# EAGLE design glcd_240x128 (EAGLE 5.06)
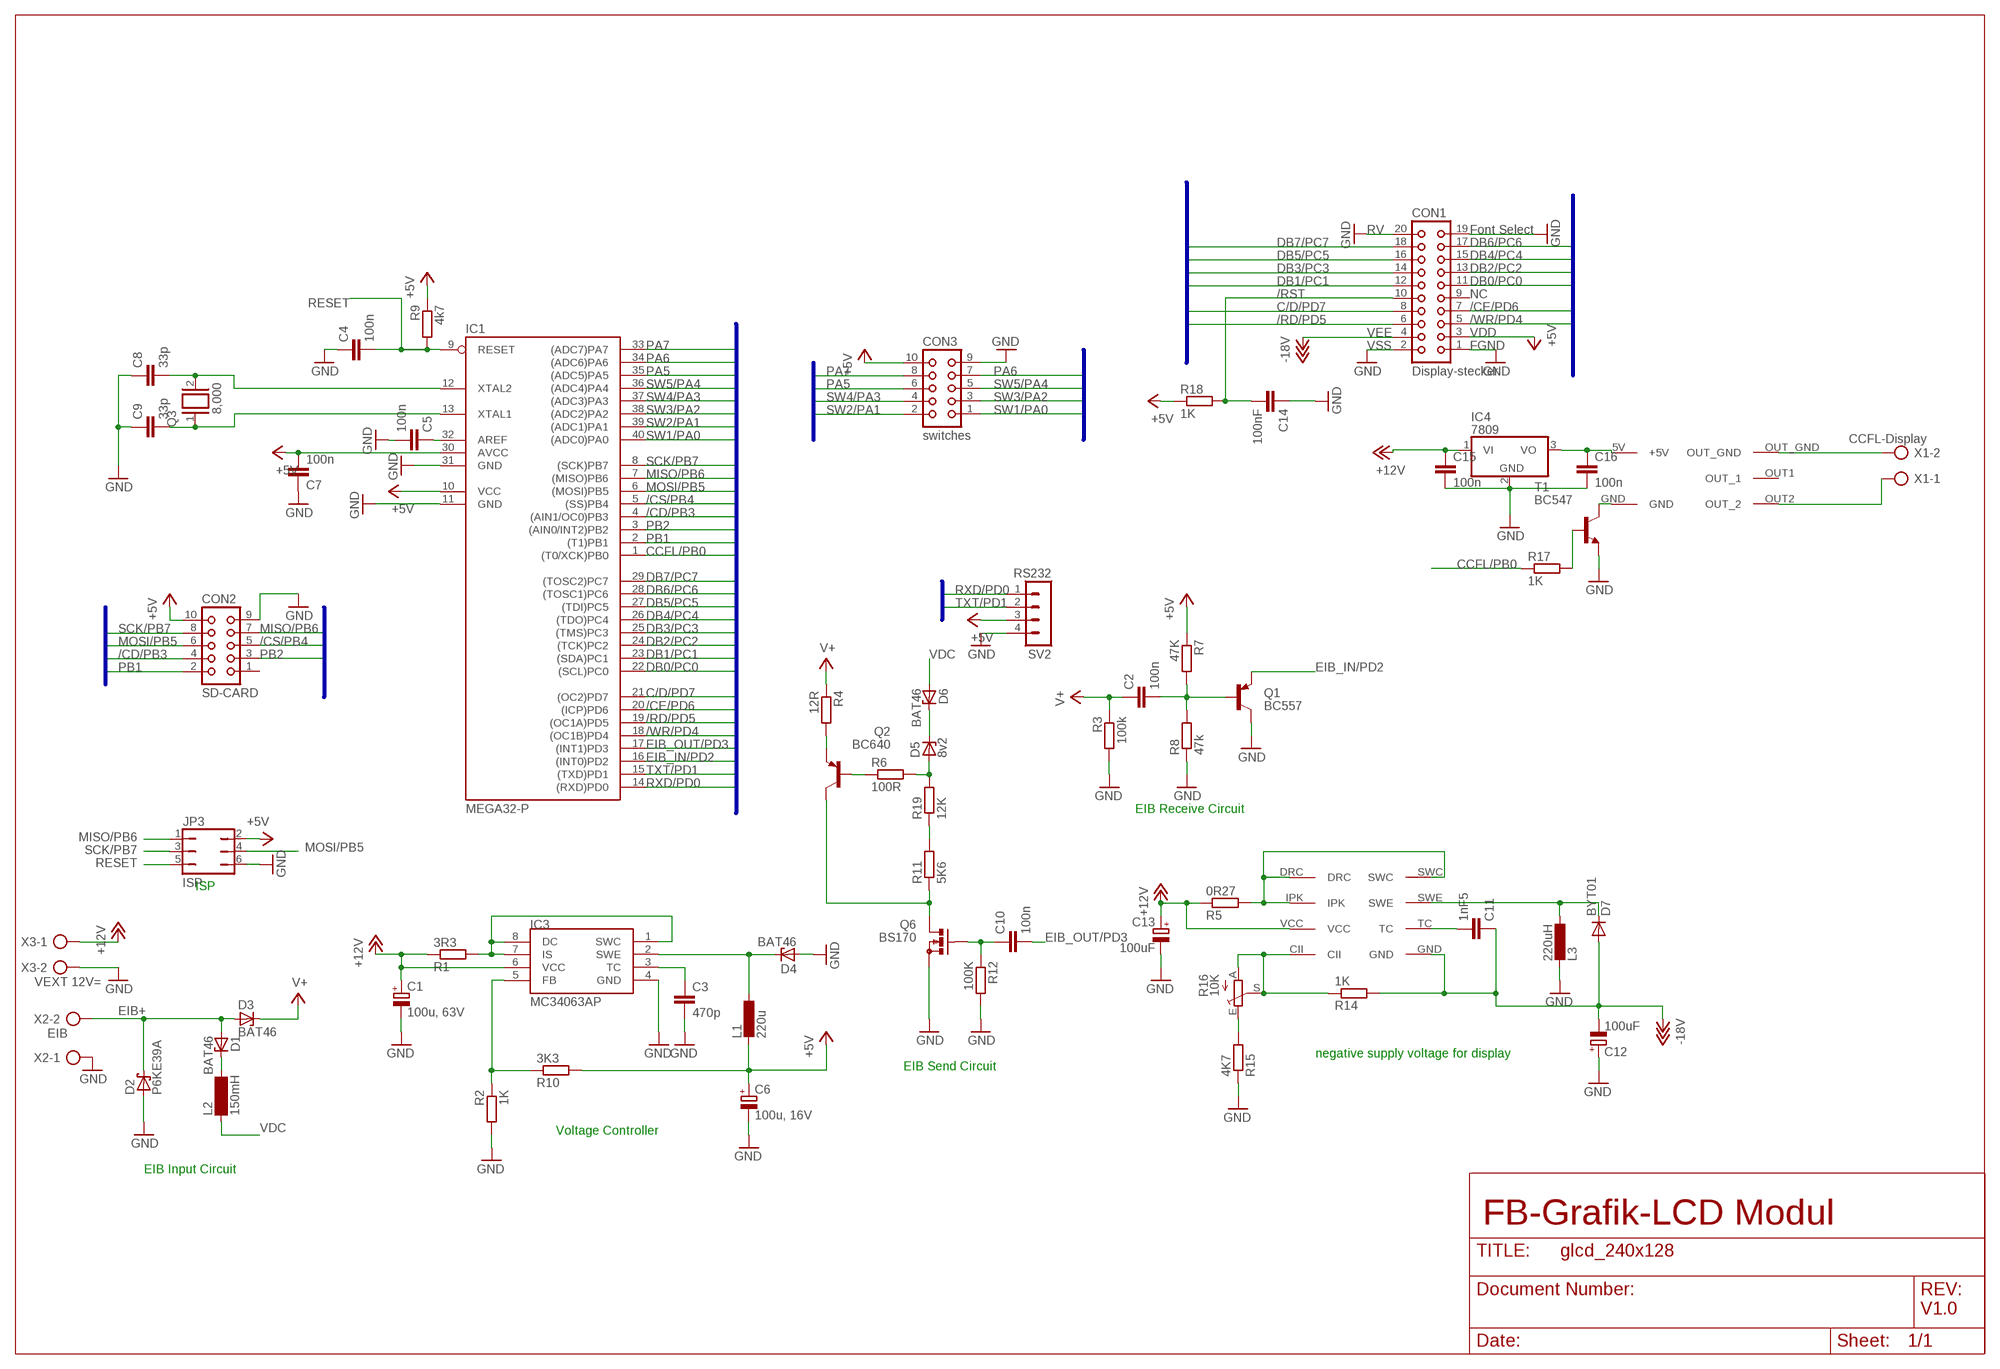
[diagram p0: schematic, sheet 1]

## Parts
C1  100u, 63V  CPOL-EUE5-10.5  [E5-10,5]
C2  100n  C-EU050-025X075  [C050-025X075]
C3  470p  C-EU025-024X044  [C025-024X044]
C4  100n  C-EU050-024X044  [C050-024X044]
C5  100n  C-EU050-025X075  [C050-025X075]
C6  100u, 16V  CPOL-EUE2.5-7  [E2,5-7]
C7  100n  C-EU050-025X075  [C050-025X075]
C8  33p  C-EU025-025X050  [C025-025X050]
C9  33p  C-EU025-025X050  [C025-025X050]
C10  100n  C-EU050-025X075  [C050-025X075]
C11  1nF5  C-EU025-024X044  [C025-024X044]
C12  100uF  CPOL-EUE5-8.5  [E5-8,5]
C13  100uF  CPOL-EUE5-8.5  [E5-8,5]
C14  100nF  C-EU025-024X044  [C025-024X044]
C15  100n  C2,5-3  [C2.5-3]
C16  100n  C2,5-3  [C2.5-3]
CON1  Display-stecker  CON20  [CON20]
CON2  SD-CARD  CON10  [CON10]
CON3  switches  CON10  [CON10]
D1  BAT46  1N821  [DO35Z10]
D2  P6KE39A  P6KEXXA  [C1702-15]
D3  BAT46  1N821  [DO35Z10]
D4  BAT46  1N821  [DO35Z10]
D5  8v2  BZX90  [DO34Z7]
D6  BAT46  1N821  [DO35Z10]
D7  BYT01  [F126-10]
IC1  MEGA32-P  [DIL40]
IC3  MC34063AP  [DIL08]
IC4  7809  7805T  [TO220H]
JP3  ISP  JP3Q  [JP3Q]
L1  220u  L-EU0207/10  [0207/10]
L2  150mH  SD12-1000  [SD12_1000]
L3  220uH  L-EU0204/7  [0204/7]
Q1  BC557  [TO92]
Q2  BC640  [TO92-BCE]
Q3  8,000  XTAL/S  [QS]
Q6  BS170  [SOT54E]
R1  3R3  R-EU_0204/2V  [0204V]
R2  1K  R-EU_0207/10  [0207/10]
R3  100k  R-EU_0207/10  [0207/10]
R4  12R  R-EU_0207/10  [0207/10]
R5  0R27  R-EU_0204/5  [0204/5]
R6  100R  R-EU_0207/10  [0207/10]
R7  47K  R-EU_0207/10  [0207/10]
R8  47k  R-EU_0207/10  [0207/10]
R9  4k7  R-EU_0204/2V  [0204V]
R10  3K3  R-EU_0207/10  [0207/10]
R11  5K6  R-EU_0204/2V  [0204V]
R12  100K  R-EU_0207/10  [0207/10]
R14  1K  R-EU_0204/7  [0204/7]
R15  4K7  R-EU_0204/7  [0204/7]
R16  10K  TRIM_EU-PT10  [PT-10]
R17  1K  R-EU_0204/7  [0204/7]
R18  1K  R-EU_0204/7  [0204/7]
R19  12K  R-EU_0204/2V  [0204V]
SV2  RS232  MA04-1  [MA04-1]
T1  BC547  -NPN-TO92  [TO92]
U$1  PCU-554  [PCU-554]
U$2  MC34063  [MC34063]
X1  CCFL-Display  AK300/2  [AK300/2]
X2  EIB  AK300/2  [AK300/2]
X3  VEXT 12V=  AK300/2  [AK300/2]

## Nets
+5V: C6.+ C7.2 CON1.3 CON2.10 CON3.10 IC1.10(VCC) IC1.30(AVCC) JP3.2 L1.2 R7.1 R9.1 R10.2 R18.1 SV2.3
+12V [supply]: C1.+ C13.+ C15.1 IC3.6(VCC) IC4.1(VI) R1.1 R5.1 U$2.VCC X3.1
-18V: C11.1 C12.- CON1.4 D7.A R14.2 U$2.GND
/CD/PB3: CON2.4 IC1.4((AIN1/OC0)PB3)
/CE/PD6: CON1.7 IC1.20((ICP)PD6)
/CS/PB4: CON2.5 IC1.5((SS)PB4)
/RD/PD5: CON1.6 IC1.19((OC1A)PD5)
/WR/PD4: CON1.5 IC1.18((OC1B)PD4)
C/D/PD7: CON1.8 IC1.21((OC2)PD7)
CCFL/PB0: IC1.1((T0/XCK)PB0) R17.1
DB0/PC0: CON1.11 IC1.22((SCL)PC0)
DB1/PC1: CON1.12 IC1.23((SDA)PC1)
DB2/PC2: CON1.13 IC1.24((TCK)PC2)
DB3/PC3: CON1.14 IC1.25((TMS)PC3)
DB4/PC4: CON1.15 IC1.26((TDO)PC4)
DB5/PC5: CON1.16 IC1.27((TDI)PC5)
DB6/PC6: CON1.17 IC1.28((TOSC1)PC6)
DB7/PC7: CON1.18 IC1.29((TOSC2)PC7)
EIB+: D1.A D2.C D3.A X2.2
EIB_IN/PD2: IC1.16((INT0)PD2) Q1.1(E)
EIB_OUT/PD3: C10.2 IC1.17((INT1)PD3)
GND: C1.- C3.2 C4.1 C5.2 C6.- C7.1 C8.1 C9.1 C12.+ C13.- C14.1 C15.2 C16.2 CON1.1 CON1.2 CON1.19 CON1.20 CON2.9 CON3.9 D2.A D4.A IC1.11(GND) IC1.31(GND) IC3.4(GND) IC4.2(GND) JP3.6 L3.2 Q1.3(C) Q6.S R2.2 R3.2 R8.1 R12.2 R15.1 SV2.4 T1.1(E) X2.1 X3.2
MISO/PB6: CON2.7 IC1.7((MISO)PB6) JP3.1
MOSI/PB5: CON2.6 IC1.6((MOSI)PB5) JP3.4
N$1: Q2.E R4.2
N$2: D5.C D6.C
N$3: C10.1 Q6.G R12.1
N$4: Q2.B R6.1
N$5: Q2.C Q6.D R11.1
N$6: D1.C L2.2
N$7 [supply]: C2.2 Q1.2(B) R7.2 R8.2
N$8: C8.2 IC1.12(XTAL2) Q3.2
N$9: C9.2 IC1.13(XTAL1) Q3.1
N$10: D5.A R6.2 R19.2
N$11: R5.2 U$2.DRC U$2.IPK U$2.SWC
N$12: IC3.1(SWC) IC3.7(IS) IC3.8(DC) R1.2
N$13: R14.1 R16.A R16.S U$2.CII
N$14: D7.C L3.1 U$2.SWE
N$15: R17.2 T1.2(B)
N$17: T1.3(C) U$1.GND
N$18: R11.2 R19.1
N$20: D4.C IC3.2(SWE) L1.1
N$21: C3.1 IC3.3(TC)
N$22: IC3.5(FB) R2.1 R10.1
N$23: R15.2 R16.E
N$24: C5.1 IC1.32(AREF)
N$25: C11.2 U$2.TC
N$27: C16.1 IC4.3(VO) U$1.5V(+5V)
N$42: C14.2 CON1.10 R18.2
N$43: U$1.OUT_GND X1.2
N$52: U$1.OUT2(OUT_2) X1.1
PA5: CON3.6 IC1.35((ADC5)PA5)
PA6: CON3.7 IC1.34((ADC6)PA6)
PA7: CON3.8 IC1.33((ADC7)PA7)
PB1: CON2.2 IC1.2((T1)PB1)
PB2: CON2.3 IC1.3((AIN0/INT2)PB2)
RESET: C4.2 IC1.9(RESET) JP3.5 R9.2
RXD/PD0: IC1.14((RXD)PD0) SV2.1
SCK/PB7: CON2.8 IC1.8((SCK)PB7) JP3.3
SW1/PA0: CON3.1 IC1.40((ADC0)PA0)
SW2/PA1: CON3.2 IC1.39((ADC1)PA1)
SW3/PA2: CON3.3 IC1.38((ADC2)PA2)
SW4/PA3: CON3.4 IC1.37((ADC3)PA3)
SW5/PA4: CON3.5 IC1.36((ADC4)PA4)
TXT/PD1: IC1.15((TXD)PD1) SV2.2
V+: C2.1 D3.C R3.1 R4.1
VDC [supply]: D6.A L2.1
Unconnected: CON1.9 CON2.1 U$1.OUT1(OUT_1)

## Buses
SW1/PA0,SW2/PA1,SW3/PA2,SW4/PA3,SW5/PA4,PA5,PA6,PA7,CCFL/PB0,PB1,PB2,/CD/PB3,/CS/PB4,MOSI/PB5,MISO/PB6,SCK/PB7,RXD/PD0,TXT/PD1,EIB_IN/PD2,EIB_OUT/PD3,/WR/PD4,/RD/PD5,/CE/PD6,C/D/PD7,DB0/PC0,DB1/PC1,DB2/PC2,DB3/PC3,DB4/PC4,DB5/PC5,DB6/PC6,DB7/PC7

## Notes on the sheet
- RV | Font Select
- /RST | NC
- VEE | VDD
- VSS | FGND
- EIB Receive Circuit
- ISP
- negative supply voltage for display
- EIB Send Circuit
- Voltage Controller
- EIB Input Circuit
- FB-Grafik-LCD Modul
- V1.0

## Library data of the parts
C1 C6 C12 C13 = rcl:CPOL-EU: POLARIZED CAPACITOR, European symbol
C2-C5 C7-C11 C14 = rcl:C-EU: CAPACITOR, European symbol
C15 C16 = capacitor-wima:C: CAPACITOR naming: grid - package width
CON1 = con-harting:CON20: CONNECTOR
CON2 CON3 = con-harting:CON10: CONNECTOR
D1 D3 D4 D6 = diode:1N821: Reference DIODE temperature compensated, 6,2 V
D2 = diode:P6KEXXA: DIODE transient-voltage suppressor
D5 = diode:BZX90: Z DIODE
D7 = diode:BYT01: DIODE ultra fast
IC1 = atmel:MEGA32-P: MICROCONTROLLER 32 Kbytes FLASH 2 Kbytes SRAM 1 Kbytes EEPROM USART 8-channel 10 bit ADC Source: www.atmel.com .. doc2503.pdf
IC3 = mc34063:MC34063
IC4 = linear:78*: Positive VOLTAGE REGULATOR Source: http://cache.national.com/ds/LM/LM78L05.pdf http://www.fairchildsemi.com/ds/LM/LM7805.pdf
JP3 = jumper:JP3Q: JUMPER
L1 L3 = rcl:L-EU: INDUCTOR, European symbol
L2 = inductor-neosid:SD12: INDUCTOR nominal inductance
Q1 = transistor-pnp:BC557: PNP Transistor
Q2 = transistor-pnp:BC640*: PNP Transistror
Q3 = special:XTAL/S: CRYSTAL
Q6 = transistor-small-signal:BS170: N-CHANNEL MOS FET
R1-R12 R14 R15 R17-R19 = rcl:R-EU_: RESISTOR, European symbol
R16 = pot:TRIM_EU-: POTENTIOMETER
SV2 = con-lstb:MA04-1: PIN HEADER
T1 = transistor:*-NPN-: NPN Transistror
U$1 = ge01:PCU-554
U$2 = ge01:MC34063
X1-X3 = con-ptr500:AK300/2: CONNECTOR

## Net classes
1 supply: width 0.406 mm

## Board
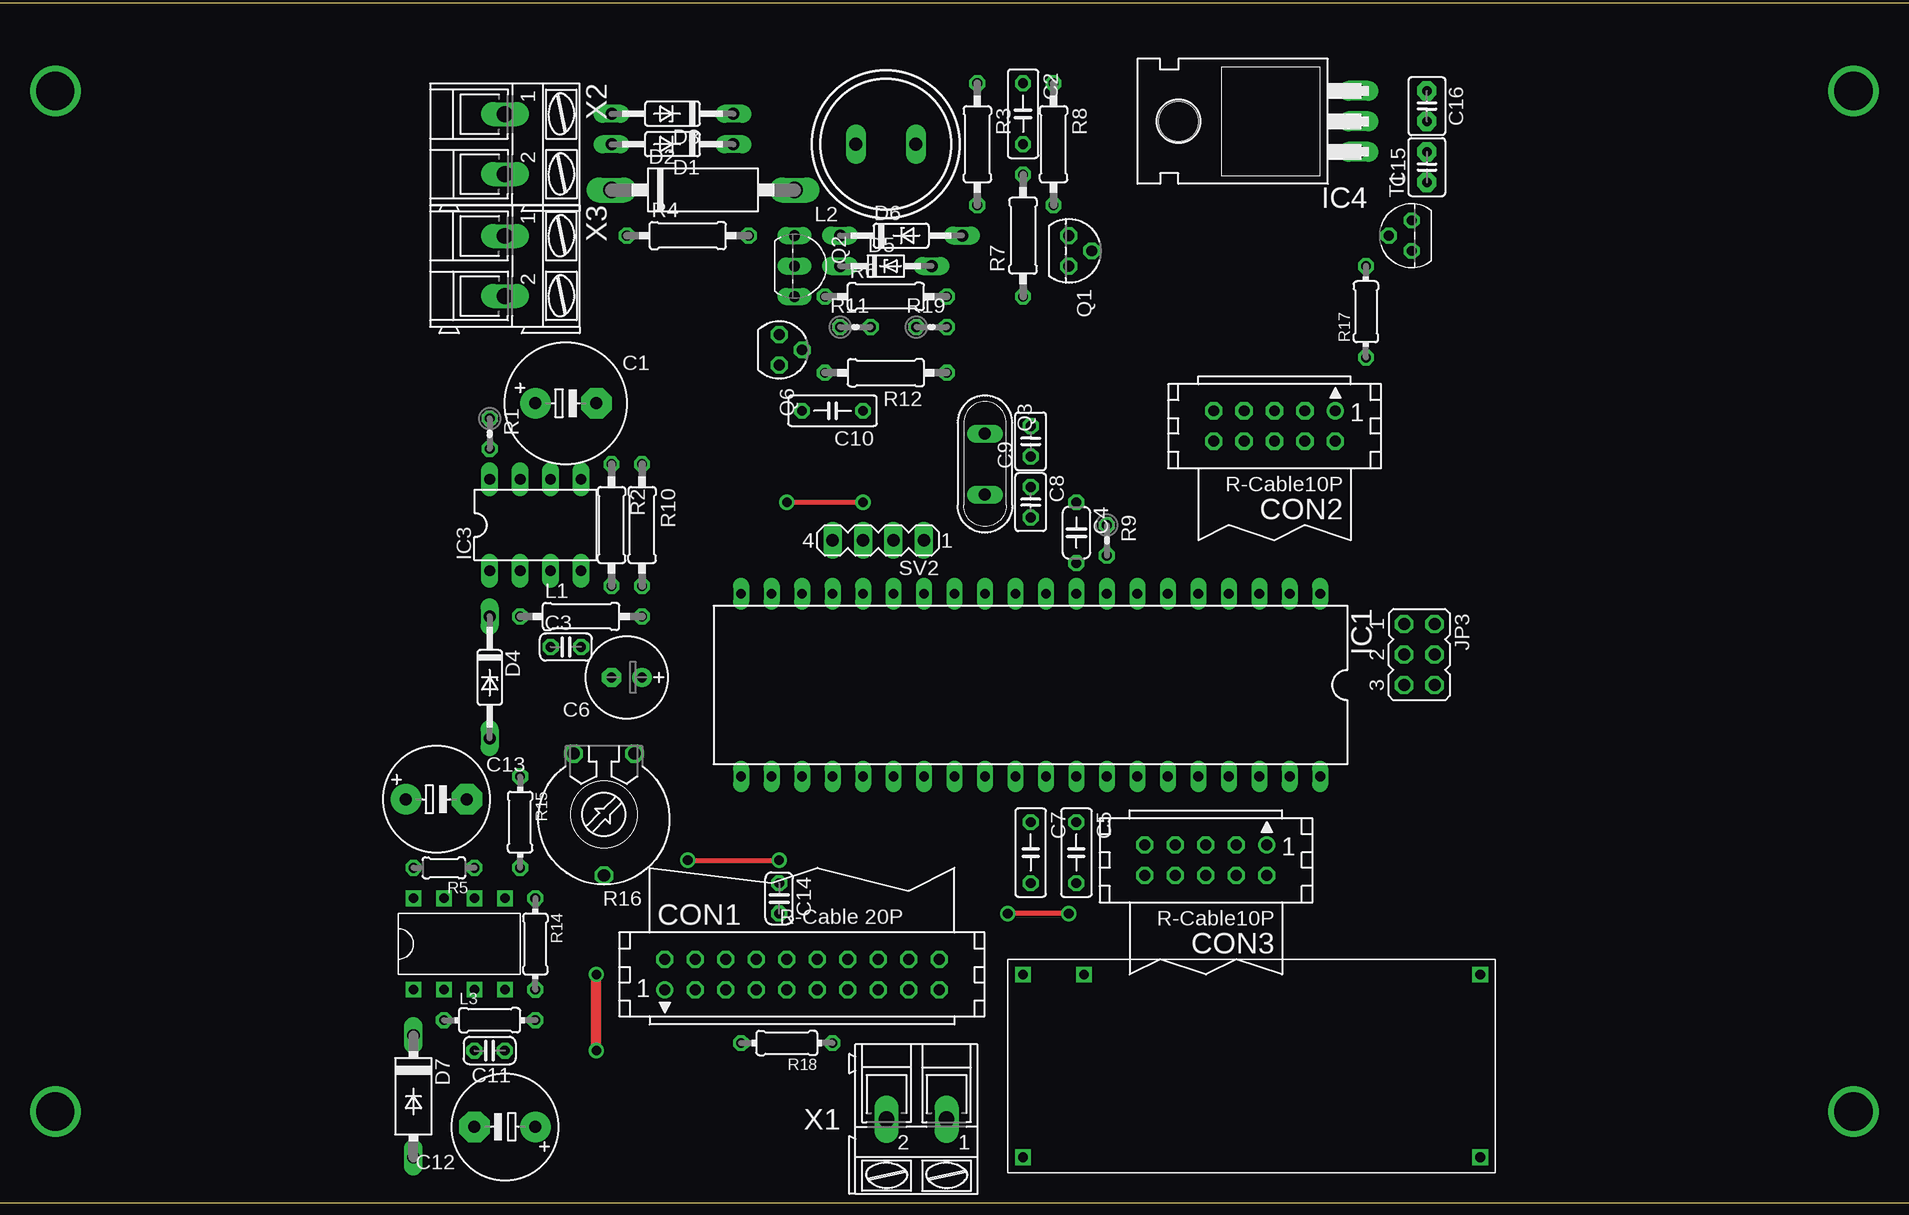
[diagram p1: board, top side]
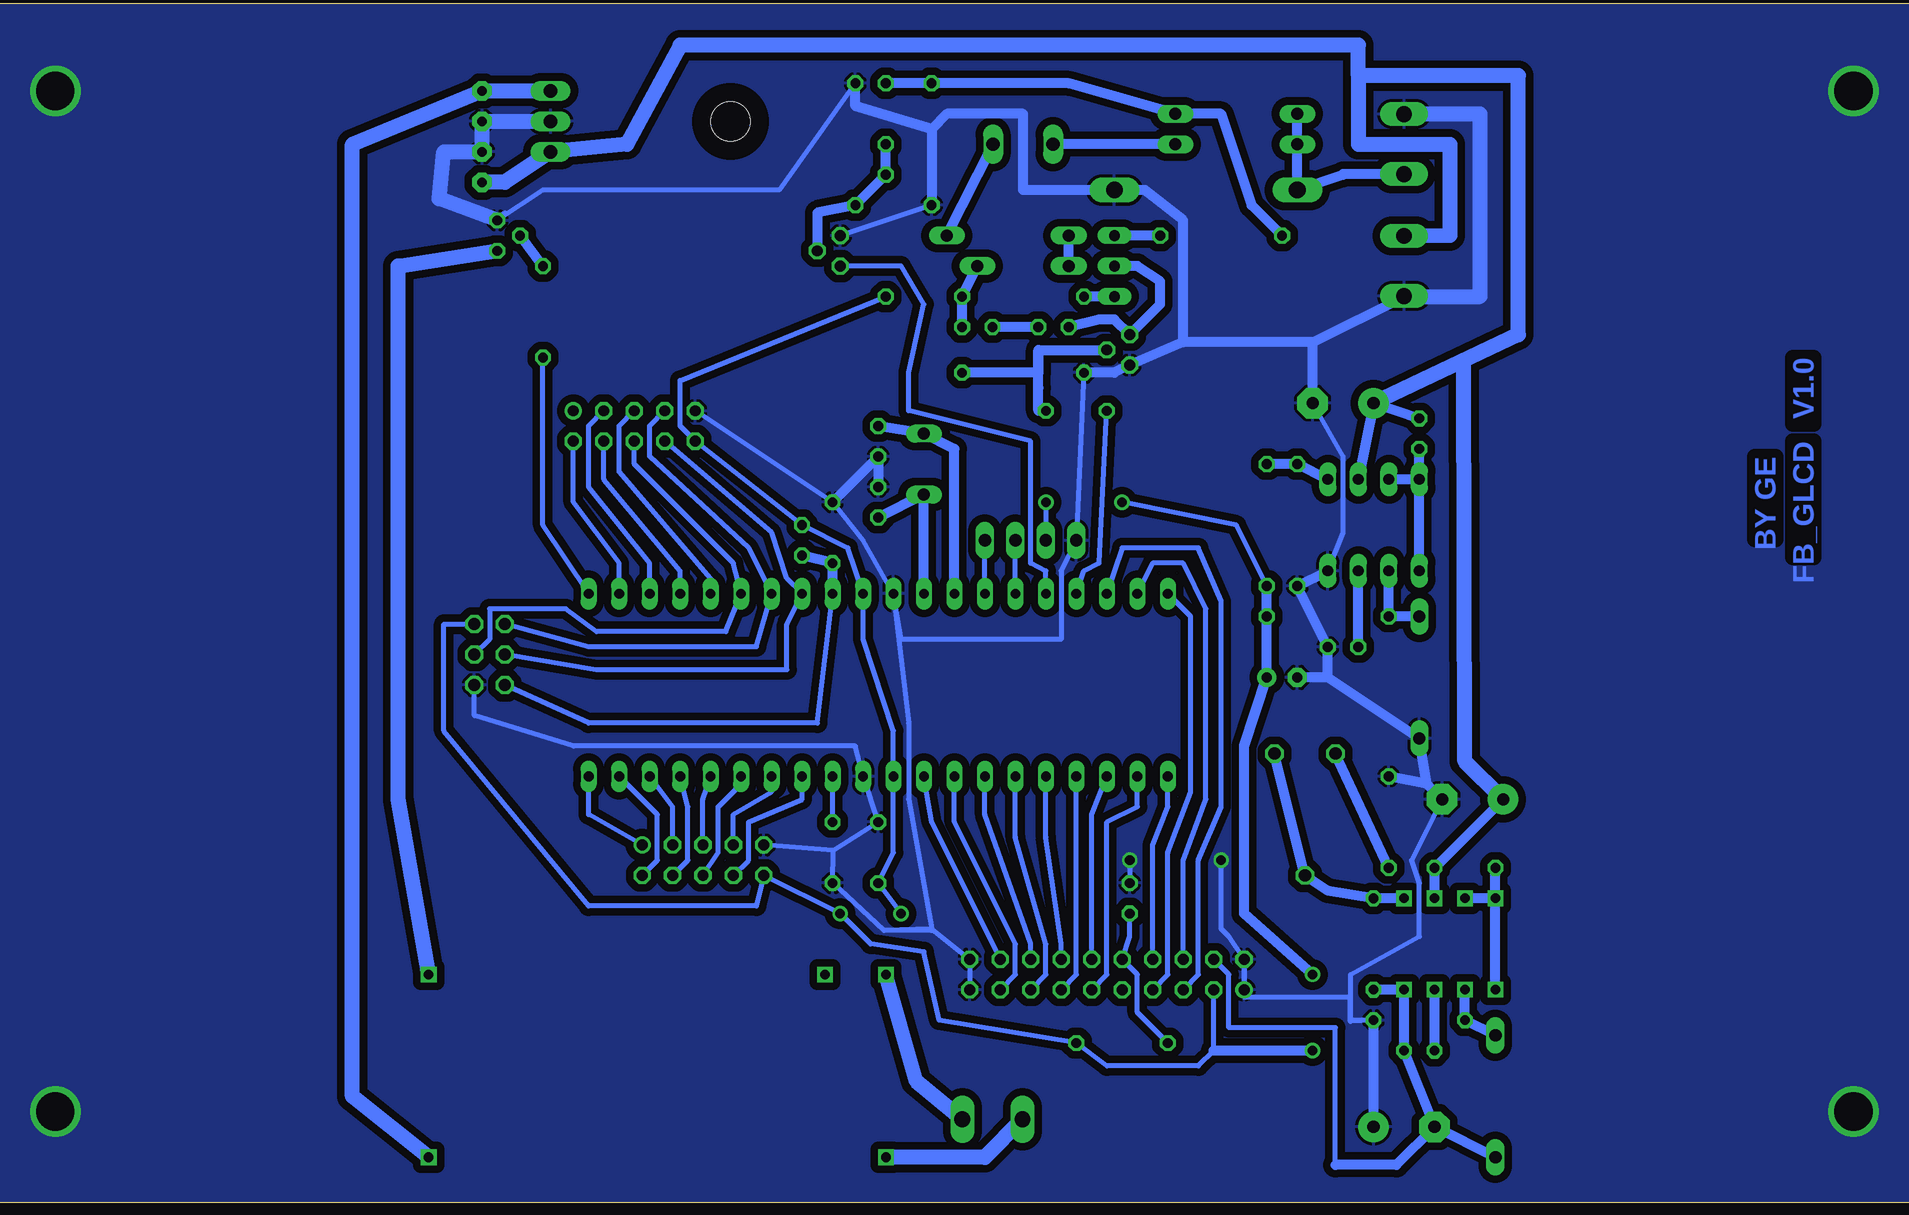
[diagram p2: board, bottom side, seen from below]

No outline drawn. Coordinates in mm, seen from the top.
Copper layers (1*16): Top 0.035mm / dielectric 1.5mm / Bottom 0.035mm
Design rules "0.3mm": minimum track width 10mil, minimum drill 24mil, track to track 0.3mm, track to pad 0.3mm, pad to pad 0.3mm, via to via 0.3mm, smd to smd 0.3mm, copper to edge 0mil, drill to drill 8mil, minimum pad ring 10mil, minimum via ring 8mil, stop-mask expansion 4mil, vias tented up to drill 0mil, thermal gap 10mil
Milling: 4 lines

### Footprints (pad centres in the part's own frame; a part is rotated, then mirrored left to right if it is on the bottom)
E5-10,5 = drill 1.016 pad 2.54 round: + -2.54,0 | drill 1.016 pad 2.54 octagon: - 2.54,0
C050-025X075 = drill 0.813 octagon: 1 -2.54,0; 2 2.54,0
C025-024X044 = drill 0.813 octagon: 1 -1.27,0; 2 1.27,0
C050-024X044 = drill 0.813 octagon: 1 -2.54,0; 2 2.54,0
E2,5-7 = drill 0.813 pad 1.6 round: + -1.27,0 | drill 0.813 pad 1.6 octagon: - 1.27,0
C025-025X050 = drill 0.813 octagon: 1 -1.27,0; 2 1.27,0
E5-8,5 = drill 1.016 pad 2.54 round: + -2.54,0 | drill 1.016 pad 2.54 octagon: - 2.54,0
C2.5-3 = drill 0.813 pad 1.6 octagon: 1 -1.27,0; 2 1.27,0
CON20 = drill 0.914 round: 1 -11.43,-1.27 | drill 0.914 octagon: 2 -11.43,1.27; 3 -8.89,-1.27; 4 -8.89,1.27; 5 -6.35,-1.27; 6 -6.35,1.27; 7 -3.81,-1.27; 8 -3.81,1.27; 9 -1.27,-1.27; 10 -1.27,1.27; 11 1.27,-1.27; 12 1.27,1.27; 13 3.81,-1.27; 14 3.81,1.27; 15 6.35,-1.27; 16 6.35,1.27; 17 8.89,-1.27; 18 8.89,1.27; 19 11.43,-1.27; 20 11.43,1.27
CON10 = drill 0.914 round: 1 -5.08,-1.27 | drill 0.914 octagon: 2 -5.08,1.27; 3 -2.54,-1.27; 4 -2.54,1.27; 5 0,-1.27; 6 0,1.27; 7 2.54,-1.27; 8 2.54,1.27; 9 5.08,-1.27; 10 5.08,1.27
DO35Z10 = drill 1 long: A 5.08,0; C -5.08,0
C1702-15 = drill 1.4 long: A 7.62,0; C -7.62,0
DO34Z7 = drill 1 long: A 3.81,0; C -3.81,0
F126-10 = drill 1.016 long: A 5.08,0; C -5.08,0
DIL40 = drill 0.813 long: 1 -24.13,-7.62; 2 -21.59,-7.62; 3 -19.05,-7.62; 4 -16.51,-7.62; 5 -13.97,-7.62; 6 -11.43,-7.62; 7 -8.89,-7.62; 8 -6.35,-7.62; 9 -3.81,-7.62; 10 -1.27,-7.62; 11 1.27,-7.62; 12 3.81,-7.62; 13 6.35,-7.62; 14 8.89,-7.62; 15 11.43,-7.62; 16 13.97,-7.62; 17 16.51,-7.62; 18 19.05,-7.62; 19 21.59,-7.62; 20 24.13,-7.62; 21 24.13,7.62; 22 21.59,7.62; 23 19.05,7.62; 24 16.51,7.62; 25 13.97,7.62; 26 11.43,7.62; 27 8.89,7.62; 28 6.35,7.62; 29 3.81,7.62; 30 1.27,7.62; 31 -1.27,7.62; 32 -3.81,7.62; 33 -6.35,7.62; 34 -8.89,7.62; 35 -11.43,7.62; 36 -13.97,7.62; 37 -16.51,7.62; 38 -19.05,7.62; 39 -21.59,7.62; 40 -24.13,7.62
DIL08 = drill 0.9 long: 1 -3.81,-3.81; 2 -1.27,-3.81; 3 1.27,-3.81; 4 3.81,-3.81; 5 3.81,3.81; 6 1.27,3.81; 7 -1.27,3.81; 8 -3.81,3.81
TO220H = drill 1.118 long: 1 -2.54,-10.16; 2 0,-10.16; 3 2.54,-10.16 | hole 3.302: 0,4.826
JP3Q = drill 1 octagon: 1 -2.54,-1.27; 2 -2.54,1.27; 3 0,-1.27; 4 0,1.27; 5 2.54,-1.27; 6 2.54,1.27
0207/10 = drill 0.813 octagon: 1 -5.08,0; 2 5.08,0
SD12_1000 = drill 1.1 long: 1 -2.5,0; 2 2.5,0
0204/7 = drill 0.813 octagon: 1 -3.81,0; 2 3.81,0
TO92 = drill 0.9 octagon: 1 1.27,0; 2 0,1.905; 3 -1.27,0
TO92-BCE = drill 0.9 long: B 2.54,0; C 0,0; E -2.54,0
QS = drill 1 long: 1 -2.54,0; 2 2.54,0
SOT54E = drill 0.9 octagon: D -1.27,0; G 0,1.905; S 1.27,0
0204V = drill 0.813 octagon: 1 -1.27,0; 2 1.27,0
0204/5 = drill 0.813 octagon: 1 -2.54,0; 2 2.54,0
PT-10 = drill 1.016 octagon: A -2.54,-5.08; E 2.54,-5.08; S 0,5.08
MA04-1 = drill 1.016 long: 1 -3.81,0; 2 -1.27,0; 3 1.27,0; 4 3.81,0
TO92' = drill 0.813 octagon: 1 1.27,0; 2 0,1.905; 3 -1.27,0
PCU-554 = drill 0.8 square: 5V 0,15.24; GND 0,0; OUT1 33.02,0; OUT2 38.1,0; OUT_GND 38.1,15.24
MC34063 = drill 0.8 square: CII 7.62,7.62; DRC 0,7.62; GND 7.62,0; IPK 2.54,7.62; SWC 0,0; SWE 2.54,0; TC 5.08,0; VCC 5.08,7.62
AK300/2 = drill 1.321 long: 1 -2.515,0; 2 2.489,0

### Placement (x,y rotation side)
C1  47.62,66.67 0 top
C2  85.72,90.81 270 top
C3  47.62,46.35 0 top
C4  90.17,55.88 270 top
C5  90.17,29.21 270 top
C6  52.7,43.81 180 top
C7  86.36,29.21 270 top
C8  86.36,58.42 270 top
C9  86.36,63.5 90 top
C10  69.85,66.04 180 top
C11  41.27,12.7 180 top
C12  42.55,6.35 180 top
C13  36.83,33.66 0 top
C14  65.41,25.4 270 top
C15  119.38,86.36 90 top
C16  119.38,91.44 270 top
CON1  67.31,19.05 0 top
CON2  106.68,64.77 180 top
CON3  100.97,28.57 180 top
D1  56.52,88.27 180 top
D2  59.05,84.45 0 top
D3  56.52,90.81 180 top
D4  41.27,43.81 270 top
D5  74.3,78.11 0 top
D6  75.56,80.64 0 top
D7  34.92,8.89 270 top
IC1  86.36,43.18 180 top
IC3  45.09,56.52 0 top
IC4  103.5,90.17 90 top
JP3  118.75,45.72 270 top
L1  48.9,48.9 0 top
L2  74.3,88.27 180 top
L3  41.27,15.24 0 top
Q1  89.53,79.38 270 top
Q2  66.67,78.11 270 top
Q3  82.55,61.59 270 top
Q6  65.41,71.12 270 top
R1  41.27,64.14 270 top
R2  51.44,56.52 270 top
R3  81.92,88.27 270 top
R4  57.78,80.64 0 top
R5  37.47,27.94 180 top
R6  74.3,75.56 0 top
R7  85.72,80.64 90 top
R8  88.27,88.27 270 top
R9  92.71,55.24 270 top
R10  53.98,56.52 270 top
R11  71.75,73.03 0 top
R12  74.3,69.22 180 top
R14  45.09,21.59 270 top
R15  43.81,31.75 270 top
R16  50.8,32.38 180 top
R17  114.3,74.3 90 top
R18  66.04,13.34 180 top
R19  78.11,73.03 0 top
SV2  73.66,55.24 180 top
T1  BC547  [TO92']  118.11,80.64 90 top
U$1  123.83,19.05 180 top
U$2  34.92,17.78 0 top
X1  76.83,6.99 180 top
X2  42.55,88.27 270 top
X3  42.55,78.11 270 top

### Tracks (layer width: path | path; a pad name or v marks a point on that pad's centre or on a via)
+5V  (via drill 0.8 pad 1.27)
  Top 0.406: v89.53,24.13 v84.45,24.13 | v66.04,58.42 v72.39,58.42
  Top 0.813: v50.16,12.7 v50.16,19.05
  Bottom 0.406: CON1.3 58.42,12.7 59.69,11.43 67.31,11.43 R18.1 81.28,15.24 82.55,20.95 87,21.59 v89.53,24.13 | v89.53,24.13 CON3.10 | v89.53,24.13 CON3.10 | v84.45,24.13 C7.2 85.09,29.21 IC1.30 85.09,39.37 87.63,46.99 IC1.10 88.9,54.61 R9.1 CON2.10 102.87,64.77 102.87,68.58 R7.1 | JP3.2 122.56,48.26 122.56,39.37 110.49,24.77 96.52,24.77 CON3.10 | v72.39,58.42 SV2.3 | v66.04,58.42 56.52,56.52 R10.2
  Bottom 0.813: R10.2 L1.2 C6.+ 55.88,38.1 55.88,24.13 v50.16,19.05 | v50.16,12.7 58.42,12.7
+12V
  Bottom 0.406: 37.56,70.03 33.02,72.39
  Bottom 0.813: R1.1 C1.+ IC3.6 | C13.+ R5.1 U$2.VCC
  Bottom 1.27: X3.1 38.73,80.64 38.73,88.27 46.35,88.27 46.35,93.98 | 46.35,93.98 46.35,96.52 102.87,96.52 107.31,88.27 IC4.1 117.47,85.09 C15.1 | C1.+ 33.02,72.39 33.02,93.98 46.35,93.98 | C13.+ 37.47,36.83 37.56,70.03
-18V
  Bottom 0.406: 48.26,3.17 48.26,14.61 57.15,14.61 57.15,19.05 CON1.4
  Bottom 0.813: C11.1 U$2.GND | C12.- C11.1 | D7.A C12.- | U$2.GND R14.2 | C11.1 U$2.GND | C12.- C11.1 | C12.- 43.18,3.17 48.26,3.17
/CD/PB3
  Bottom 0.406: CON2.4 109.22,60.33 102.87,52.7 IC1.4
/CE/PD6
  Bottom 0.406: CON1.7 62.23,19.05 62.23,29.21 60.33,34.29 60.33,48.9 IC1.20
/CS/PB4
  Bottom 0.406: IC1.5 100.33,52.07 107.95,60.96 107.95,64.77 CON2.5
/RD/PD5
  Bottom 0.406: CON1.6 60.96,28.57 59.05,33.66 59.05,49.53 60.96,53.34 63.5,53.34 IC1.19
/WR/PD4
  Bottom 0.406: IC1.18 66.04,54.61 59.69,54.61 57.78,50.16 57.78,33.02 59.69,28.57 59.69,19.05 CON1.5
C/D/PD7
  Bottom 0.406: IC1.21 62.23,33.02 63.5,29.84 CON1.8
CCFL/PB0
  Bottom 0.406: IC1.1 114.3,56.52 R17.1
DB0/PC0
  Bottom 0.406: CON1.11 67.31,19.05 67.31,31.75 64.77,33.02 IC1.22
DB1/PC1
  Bottom 0.406: IC1.23 68.58,32.38 CON1.12
DB2/PC2
  Bottom 0.406: CON1.13 69.85,19.05 IC1.24
DB3/PC3
  Bottom 0.406: IC1.25 72.39,30.48 71.12,21.59 CON1.14
DB4/PC4
  Bottom 0.406: IC1.26 74.93,30.48 72.39,21.59 72.39,19.05 CON1.15
DB5/PC5
  Bottom 0.406: CON1.16 73.66,21.59 77.47,32.38 IC1.27
DB6/PC6
  Bottom 0.406: IC1.28 80.01,31.75 74.93,21.59 74.93,19.05 CON1.17
DB7/PC7
  Bottom 0.406: CON1.18 81.92,31.75 IC1.29
EIB+
  Bottom 0.813: X2.2 47.62,85.78 47.62,85.72 D2.C D1.A D3.A
EIB_IN/PD2
  Bottom 0.406: Q1.1 84.45,78.11 82.55,74.93 83.82,69.22 83.82,66.04 73.66,63.5 73.66,53.34 72.39,52.7 IC1.16
EIB_OUT/PD3
  Bottom 0.406: IC1.17 69.22,52.7 67.94,53.34 C10.2
GND  (via drill 0.8 pad 1.27, 3.2)
  Top 0.406: v57.78,28.57 v65.41,28.57
  Bottom 0.406: 90.11,29.4 CON3.9 | 90.11,29.4 C7.1 IC1.31 88.27,38.1 111.76,38.1 120.02,40.64 JP3.6 | 90.11,29.4 C5.2 85.88,22.71 | 85.88,22.71 81.92,22.71 81.92,22.86 | 81.92,22.86 CON1.20 CON1.19 | CON1.2 CON1.1 | C1.- 47.62,62.23 47.62,55.88 IC3.4 | R3.2 Q1.3 | R12.2 SV2.4 71.12,52.7 71.12,46.99 84.45,46.99 IC1.11 | CON1.2 55.88,17.14 46.99,17.14 46.99,15.24 L3.2 47.02,15.13 46.99,19.05 41.27,22.23 41.27,26.67 41.91,28.57 C13.- | IC1.11 83.82,40.01 83.82,33.66 81.92,22.86 | 81.92,22.86 85.88,22.71 | CON1.2 57.15,22.23 57.78,22.86 v57.78,28.57 | v65.41,28.57 C14.1 | CON2.9 C4.1 87.63,55.24 IC1.11 | 117.47,82.55 T1.1 114.3,84.45 94.61,84.45 R8.1
  Bottom 0.813: 36.2,90.78 36.2,90.81 | X3.2 42.55,75.56 50.16,71.75 | 81.92,89.53 R3.2 | 81.92,89.53 88.27,91.44 R8.1 | 81.92,89.53 80.64,90.81 74.3,90.81 74.3,84.45 D2.A 64.14,84.45 60.96,81.92 60.96,71.75 | 60.96,71.75 Q6.S 66.67,69.22 R12.2 | C1.- 50.16,71.75 | 48.9,43.81 D4.A 40.64,34.92 | 48.9,43.81 C6.- | 48.9,43.81 C3.2 R2.2 IC3.4 | 40.64,34.92 R15.1 | C13.- 40.64,34.92 | C12.+ L3.2 | C8.1 C9.1 C4.1 | 50.16,71.75 60.96,71.75
  Bottom 1.27: X2.1 36.2,90.78 36.2,75.56 42.55,75.56 | IC4.2 C16.2 C15.2 122.56,87.63 122.96,83.72 T1.1
  other vias: 5.08,92.71 5.08,7.62 154.94,7.62 154.94,92.71
  pour Bottom (isolate 0.637): 0,0 160.02,0 160,100 0,100
MISO/PB6
  Bottom 0.406: CON2.7 105.41,64.77 105.41,62.23 97.16,54.61 IC1.7 96.52,46.35 110.49,46.35 JP3.1
MOSI/PB5
  Bottom 0.406: CON2.6 106.68,61.59 98.42,53.34 IC1.6 99.06,47.62 109.86,47.62 112.39,49.53 118.75,49.53 118.75,46.99 JP3.4
N$1
  Bottom 0.813: R4.2 Q2.E
N$2
  Bottom 0.813: D5.C D6.C
N$3
  Bottom 0.813: 73.03,71.12 Q6.G | 73.03,66.04 73.03,67.94 73.03,71.12 | C10.1 73.03,66.04 | 73.03,66.04 73.03,71.12 | 73.03,71.12 73.03,69.22 R12.1
N$4
  Bottom 0.813: Q2.B R6.1
N$5
  Bottom 0.813: Q2.C 64.77,78.11 62.87,76.83 62.87,74.93 Q6.D 66.67,73.66 67.94,73.66 R11.1
N$6
  Bottom 0.813: D1.C L2.2
N$7
  Bottom 0.813: C2.2 R7.2 R8.2 91.44,82.55 Q1.2
N$8
  Bottom 0.813: IC1.12 Q3.2 C8.2
N$9
  Bottom 0.813: C9.2 Q3.1 80.01,62.87 IC1.13
N$10
  Bottom 0.813: D5.A R6.2 R19.2
N$11
  Bottom 0.813: U$2.DRC R5.2 | U$2.DRC U$2.IPK | U$2.SWC U$2.DRC
N$12
  Bottom 0.813: IC3.8 R1.2 | IC3.1 IC3.8 | IC3.8 IC3.7
N$13
  Bottom 0.813: U$2.CII R14.1 48.9,26.04 R16.S R16.A
N$14
  Bottom 0.813: U$2.SWE L3.1 D7.C
N$15
  Bottom 0.813: R17.2 T1.2
N$17
  Bottom 1.27: U$1.GND 126.36,33.66 126.36,78.11 T1.3
N$18
  Bottom 0.813: R11.2 R19.1
N$20
  Bottom 0.813: IC3.2 L1.1 D4.C
N$21
  Bottom 0.813: C3.1 IC3.3
N$22
  Bottom 0.813: R10.1 R2.1 IC3.5
N$23
  Bottom 0.813: R15.2 R16.E
N$24
  Bottom 0.406: C5.1 IC1.32
N$25
  Bottom 0.813: C11.2 U$2.TC
N$27
  Bottom 1.27: IC4.3 C16.1 130.18,88.27 130.18,8.89 U$1.5V
N$42
  Bottom 0.406: R18.2 64.77,15.88 64.77,19.05 CON1.10 65.41,22.23 C14.2
N$43
  Bottom 1.27: X1.2 77.47,3.81 U$1.OUT_GND
N$52
  Bottom 1.27: U$1.OUT2 83.19,10.16 X1.1
PA5
  Bottom 0.406: IC1.35 97.79,34.92 99.69,33.02 99.69,29.21 CON3.6
PA6
  Bottom 0.406: CON3.7 98.42,32.38 95.25,34.29 IC1.34
PA7
  Bottom 0.406: CON3.8 97.16,28.57 97.16,31.75 92.71,33.66 IC1.33
PB1
  Bottom 0.406: IC1.2 107.95,53.34 111.76,58.42 CON2.2
PB2
  Bottom 0.406: IC1.3 105.41,53.34 110.49,59.69 110.49,64.77 CON2.3
RESET
  Bottom 0.406: JP3.5 110.49,40.01 91.44,40.01 IC1.9
  Bottom 0.813: IC1.9 C4.2 R9.2
RXD/PD0
  Bottom 0.406: IC1.14 SV2.1
SCK/PB7
  Bottom 0.406: JP3.3 109.86,44.45 93.98,44.45 93.98,48.26 IC1.8 93.98,52.07 95.25,55.88 CON2.8
SW1/PA0
  Bottom 0.406: IC1.40 110.49,32.38 CON3.1
SW2/PA1
  Bottom 0.406: IC1.39 104.78,32.38 104.78,28.57 CON3.2
SW3/PA2
  Bottom 0.406: IC1.38 103.5,33.02 CON3.3
SW4/PA3
  Bottom 0.406: IC1.37 102.23,33.02 102.23,28.57 CON3.4
SW5/PA4
  Bottom 0.406: CON3.5 100.97,33.66 IC1.36
TXT/PD1
  Bottom 0.406: IC1.15 SV2.2
V+
  Bottom 0.813: R4.1 55.24,83.19 57.78,90.81 D3.C 70.48,93.34 R3.1 C2.1
VDC
  Bottom 0.813: D6.A L2.1

### Text on the board
Bottom: V1.0 | FB_GLCD | BY GE